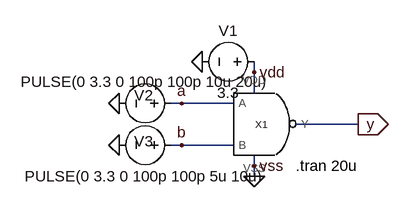
[diagram p0: schematic nand1x_tb_tran.asc]
nand1x_tb_tran.asc, the LTspice schematic file:
Version 4.1
SHEET 1 880 680
WIRE 176 80 176 64
WIRE 176 112 176 80
WIRE 64 128 48 128
WIRE 144 128 64 128
WIRE 336 160 240 160
WIRE 64 192 48 192
WIRE 144 192 64 192
WIRE 176 224 176 208
WIRE 176 240 176 224
FLAG 176 240 0
FLAG 96 64 0
FLAG -32 128 0
FLAG -32 192 0
FLAG 336 160 y
IOPIN 336 160 Out
FLAG 64 192 b
FLAG 64 128 a
FLAG 176 224 vss
FLAG 176 80 vdd
SYMBOL voltage 192 64 R90
WINDOW 0 -32 56 VBottom 2
WINDOW 3 32 56 VTop 2
WINDOW 123 0 0 Left 0
WINDOW 39 0 0 Left 0
SYMATTR InstName V1
SYMATTR Value 3.3
SYMBOL voltage 64 128 R90
WINDOW 0 3 58 VBottom 2
WINDOW 3 -49 55 VTop 2
WINDOW 123 0 0 Left 0
WINDOW 39 0 0 Left 0
SYMATTR InstName V2
SYMATTR Value PULSE(0 3.3 0 100p 100p 10u 20u)
SYMBOL voltage 64 192 R90
WINDOW 0 10 58 VBottom 2
WINDOW 3 32 56 VTop 2
WINDOW 123 0 0 Left 0
WINDOW 39 0 0 Left 0
SYMATTR InstName V3
SYMATTR Value PULSE(0 3.3 0 100p 100p 5u 10u)
SYMBOL nand1x 192 160 R0
SYMATTR InstName X1
TEXT 240 224 Left 2 !.tran 20u

The netlist it stands for:
* nand1x_tb_tran.asc
V1 vdd 0 3.3
V2 a 0 PULSE(0 3.3 0 100p 100p 10u 20u)
V3 b 0 PULSE(0 3.3 0 100p 100p 5u 10u)
X§X1 y vdd 0 a b nand1x  ; pins Y VDD VSS A B
.tran 20u
.backanno
.end